# EAGLE design tiny45-ir (EAGLE 5.06)
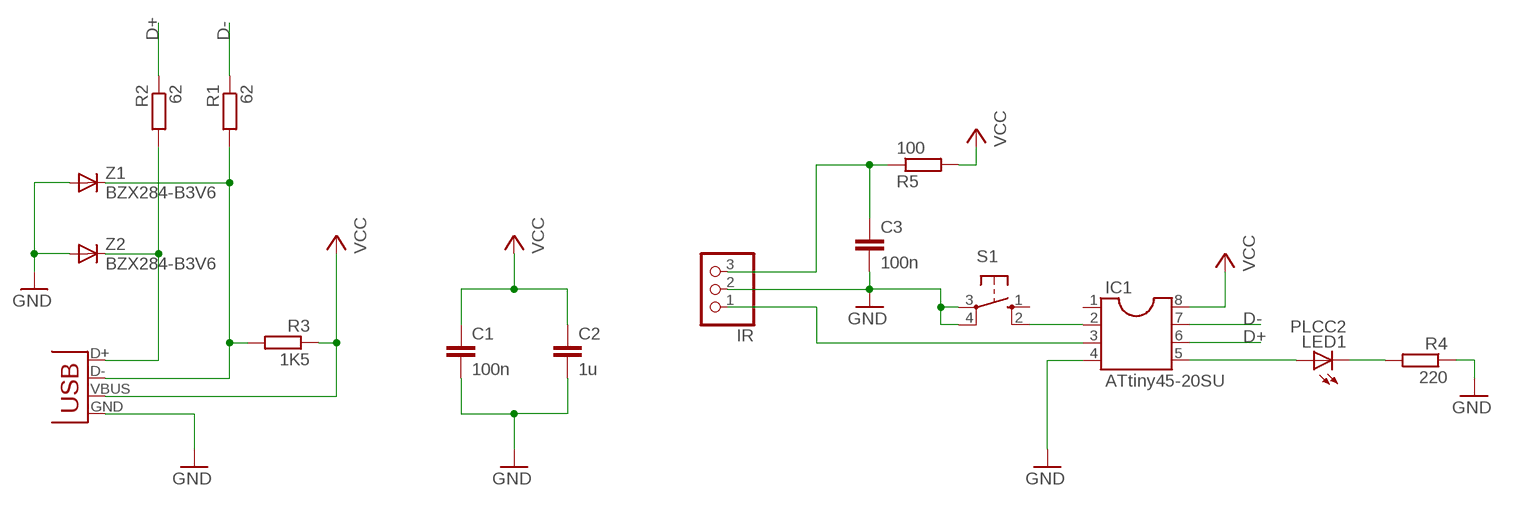
[diagram p0: schematic, sheet 1]

## Parts
C1  100n  C-EUC1206  [C1206]
C2  1u  C-EUC1206  [C1206]
C3  100n  C-EUC1206  [C1206]
IC1  ATtiny45-20SU  DIL8-8S2  [8S2]
IR  PINHD-1X3  [1X03]
LED1  PLCC2  LG_T679-E1F1-1  [PLCC2]
R1  62  R-EU_R0805  [R0805]
R2  62  R-EU_R0805  [R0805]
R3  1K5  R-EU_R0805  [R0805]
R4  220  R-EU_R0805  [R0805]
R5  100  R-EU_R0805  [R0805]
S1  10-XX  [B3F-10XX]
X1  USB-PCB  [USB-A-PCB]
Z1  BZX284-B3V6  DIODE-SOD110-W  [SOD110-W]
Z2  BZX284-B3V6  DIODE-SOD110-W  [SOD110-W]

## Nets
D+: IC1.6 R2.1
D-: IC1.7 R1.1
GND: C1.2 C2.2 C3.2 IC1.4 IR.2 R4.1 S1.3(P) S1.4(P1) X1.GND Z1.A Z2.A
N$1: R2.2 X1.D+ Z2.C
N$2: R1.2 R3.2 X1.D- Z1.C
N$3: LED1.C R4.2
N$4: IC1.5 LED1.A
N$5: IC1.3 IR.1
N$6: IC1.2 S1.2(S1)
N$7: C3.1 IR.3 R5.1
VCC: C1.1 C2.1 IC1.8 R3.1 R5.2 X1.VBUS
Unconnected: IC1.1 S1.1(S)

## Library data of the parts
C1-C3 = rcl:C-EU: CAPACITOR, European symbol
IC1 = chris:DIL8: Dual In Line
IR = pinhead:PINHD-1X3: PIN HEADER
LED1 = led:*_T679-?-1: LC TOPLED® Low Current LED Source: http://catalog.osram-os.com .. LG_LS_LY_T679_OBS.pdf; COLOR: green
R1-R5 = resistor:R-EU_: RESISTOR, European symbol
S1 = switch-omron:10-XX: OMRON SWITCH
X1 = chris:USB: USB Connectors
Z1 Z2 = diode:DIODE-: DIODE

## Board
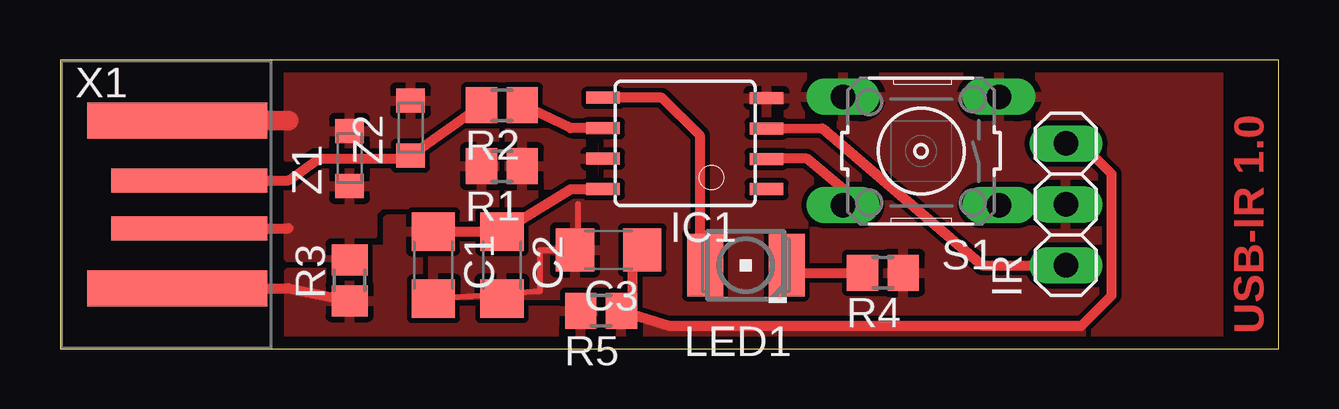
[diagram p1: board, top side]

Size 50.79 x 12.05 mm. Coordinates in mm from the lower left corner, seen from the top.
Outline: 0,0 50.79,0 50.79,12.05 0,12.05 0,0
Copper layers (1*16): Top 0.035mm / dielectric 1.5mm / Bottom 0.035mm
Design rules "default *": minimum track width 10mil, minimum drill 24mil, track to track 8mil, track to pad 8mil, pad to pad 8mil, via to via 8mil, smd to smd 8mil, copper to edge 20mil, drill to drill 8mil, minimum pad ring 10mil, minimum via ring 8mil, stop-mask expansion 4mil, vias tented up to drill 0mil, thermal gap 10mil

### Footprints (pad centres in the part's own frame; a part is rotated, then mirrored left to right if it is on the bottom)
C1206 = smd 1.6 x 1.8: 1 -1.4,0; 2 1.4,0
8S2 = smd 0.5 x 1.4: 1 -1.905,-3.404; 2 -0.645,-3.404; 3 0.625,-3.404; 4 1.895,-3.404; 5 1.905,3.404; 6 0.635,3.404; 7 -0.635,3.404; 8 -1.905,3.404
1X03 = drill 1.016 long: 1 -2.54,0; 2 0,0; 3 2.54,0
PLCC2 = smd 2.6 x 1.5: A 0,1.7; C 0,-1.7
R0805 = smd 1.3 x 1.5: 1 -0.85,0; 2 0.85,0
B3F-10XX = drill 1.016 long: 1 -3.251,2.261; 2 3.251,2.261; 3 -3.251,-2.261; 4 3.251,-2.261
USB-A-PCB = smd 6.5 x 1: D+ 0.3,1; D- 0.3,-1 | smd 7.5 x 1.5: GND -0.2,3.5; VBUS -0.2,-3.5
SOD110-W = smd 1 x 1.2: A 1.15,0; C -1.15,0

### Placement (x,y rotation side)
C1  15.56,3.49 270 top
C2  18.41,3.49 270 top
C3  22.86,4.13 180 top
IC1  26.04,8.57 90 top
IR  41.91,6.03 90 top
LED1  28.57,3.49 90 top
R1  18.41,7.62 180 top
R2  18.41,10.16 180 top
R3  12.06,2.86 90 top
R4  34.29,3.17 180 top
R5  22.54,1.59 180 top
S1  35.88,8.26 180 top
X1  5.08,6.03 0 top
Z1  12.06,7.94 90 top
Z2  14.61,9.21 90 top

### Tracks (layer width: path | path; a pad name or v marks a point on that pad's centre or on a via)
D+
  Top 0.406: R2.1 21.27,9.21 IC1.6
D-
  pour Top: 18.73,5.71 18.73,9.84 21.27,8.57 22.23,8.57 22.23,7.3 21.27,6.99
GND
  Top 0.254: C1.2 20,2.41 20,4.13 21.59,4.13 21.59,6.03
  Top 0.813: X1.GND 9.53,9.53
  pour Top: 9.53,7.94 9.53,12.38 48.26,12.38 48.26,-0.32 43.18,-0.32 43.18,1.59 22.86,1.59 22.86,2.22 15.56,2.22 15.56,4.76 18.73,4.76 21.59,6.35 22.86,6.35 22.86,9.21 21.59,9.21 19.37,10.48 17.46,10.48 14.29,8.57 10.48,8.57
N$1
  Top 0.406: X1.D+ 9.53,7.03 10.79,7.94 14.61,7.94 Z2.C R2.2
N$2
  Top 0.406: X1.D- 9.53,5.03
  pour Top: 13.34,6.03 13.02,5.71 13.02,4.76 12.38,4.76 12.38,3.81 9.53,3.81 9.53,6.99 10.79,7.94 14.61,7.94 18.1,9.84 18.1,5.4 15.56,5.4 15.56,6.03
N$3
  Top 0.406: R4.2 30.27,3.17 LED1.C
N$4
  Top 0.406: IC1.5 25.08,10.48 26.67,8.89 26.67,3.7 LED1.A
N$5
  Top 0.406: IR.1 38.42,3.49 31.75,9.21 IC1.3
N$6
  Top 0.406: S1.2 32.63,6.67 31.11,7.94 IC1.2
N$7
  Top 0.406: IR.3 42.55,8.57 43.81,7.3 43.81,2.22 42.55,0.95 25.4,0.95 23.87,1.44 | R5.1 23.87,1.44 | C3.1 23.87,4.13 23.87,1.44
  pour Top: 42.55,-0.32 42.55,0.95 22.86,0.95 22.86,-0.32
VCC
  Top 0.406: X1.VBUS 9.53,2.53 R3.1 | C1.1 C2.1 21.27,6.67 IC1.8
  pour Top: 22.23,-0.32 22.23,1.59 14.92,1.59 14.92,5.4 13.65,5.4 13.65,4.13 13.02,4.13 13.02,3.17 9.53,3.17 9.53,-0.32

### Text on the board
Top: USB-IR 1.0